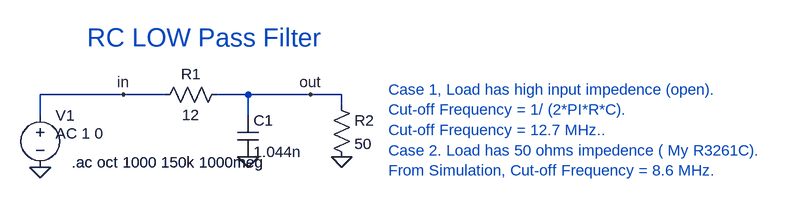
[diagram p0: schematic LP_RC_FILT.asc]
LP_RC_FILT.asc, the LTspice schematic file:
Version 4
SHEET 1 1048 680
WIRE 32 160 -96 160
WIRE 96 160 32 160
WIRE 224 160 176 160
WIRE 320 160 224 160
WIRE 368 160 320 160
WIRE 368 176 368 160
WIRE -96 192 -96 160
WIRE 224 192 224 160
FLAG 32 160 in
FLAG 320 160 out
FLAG 224 256 0
FLAG -96 272 0
FLAG 368 256 0
SYMBOL res 192 144 R90
WINDOW 0 0 56 VBottom 2
WINDOW 3 32 56 VTop 2
SYMATTR InstName R1
SYMATTR Value 12
SYMBOL cap 208 192 R0
SYMATTR InstName C1
SYMATTR Value 1.044n
SYMBOL voltage -96 176 R0
WINDOW 123 24 44 Left 2
WINDOW 39 0 0 Left 0
SYMATTR Value2 AC 1 0
SYMATTR InstName V1
SYMATTR Value ""
SYMBOL res 352 160 R0
SYMATTR InstName R2
SYMATTR Value 50
TEXT -48 264 Left 2 !.ac oct 1000 150k 1000meg
TEXT -24 72 Left 4 ;RC LOW Pass Filter
TEXT 440 152 Left 2 ;Case 1, Load has high input impedence (open).\nCut-off Frequency = 1/ (2*PI*R*C).\nCut-off Frequency = 12.7 MHz..\nCase 2. Load has 50 ohms impedence ( My R3261C).\nFrom Simulation, Cut-off Frequency = 8.6 MHz.

The netlist it stands for:
* LP_RC_FILT.asc
R1 out in 12
C1 out 0 1.044n
V1 in 0 AC 1 0
R2 out 0 50
.ac oct 1000 150k 1000meg
* RC LOW Pass Filter
* Case 1, Load has high input impedence (open).
* Cut-off Frequency = 1/ (2*PI*R*C).
* Cut-off Frequency = 12.7 MHz..
* Case 2. Load has 50 ohms impedence ( My R3261C).
* From Simulation, Cut-off Frequency = 8.6 MHz.
.backanno
.end

* Results of the author's LTspice run, read from the files saved beside the schematic
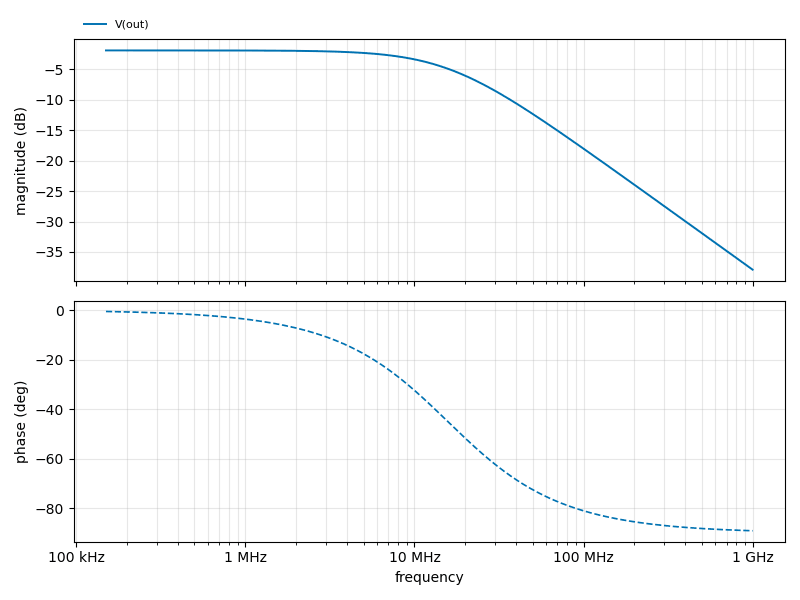
[diagram p1: AC Analysis of LP_RC_FILT.asc, plotted from the saved traces]
* AC Analysis, 1 run:
*   V(out): -1.87 dB at 150 kHz, -37.92 dB at 1 GHz, peak -1.87 dB at 150 kHz, 3 dB below the peak at 15.75 MHz